# Altium project keyMANDevices.PrjPCB
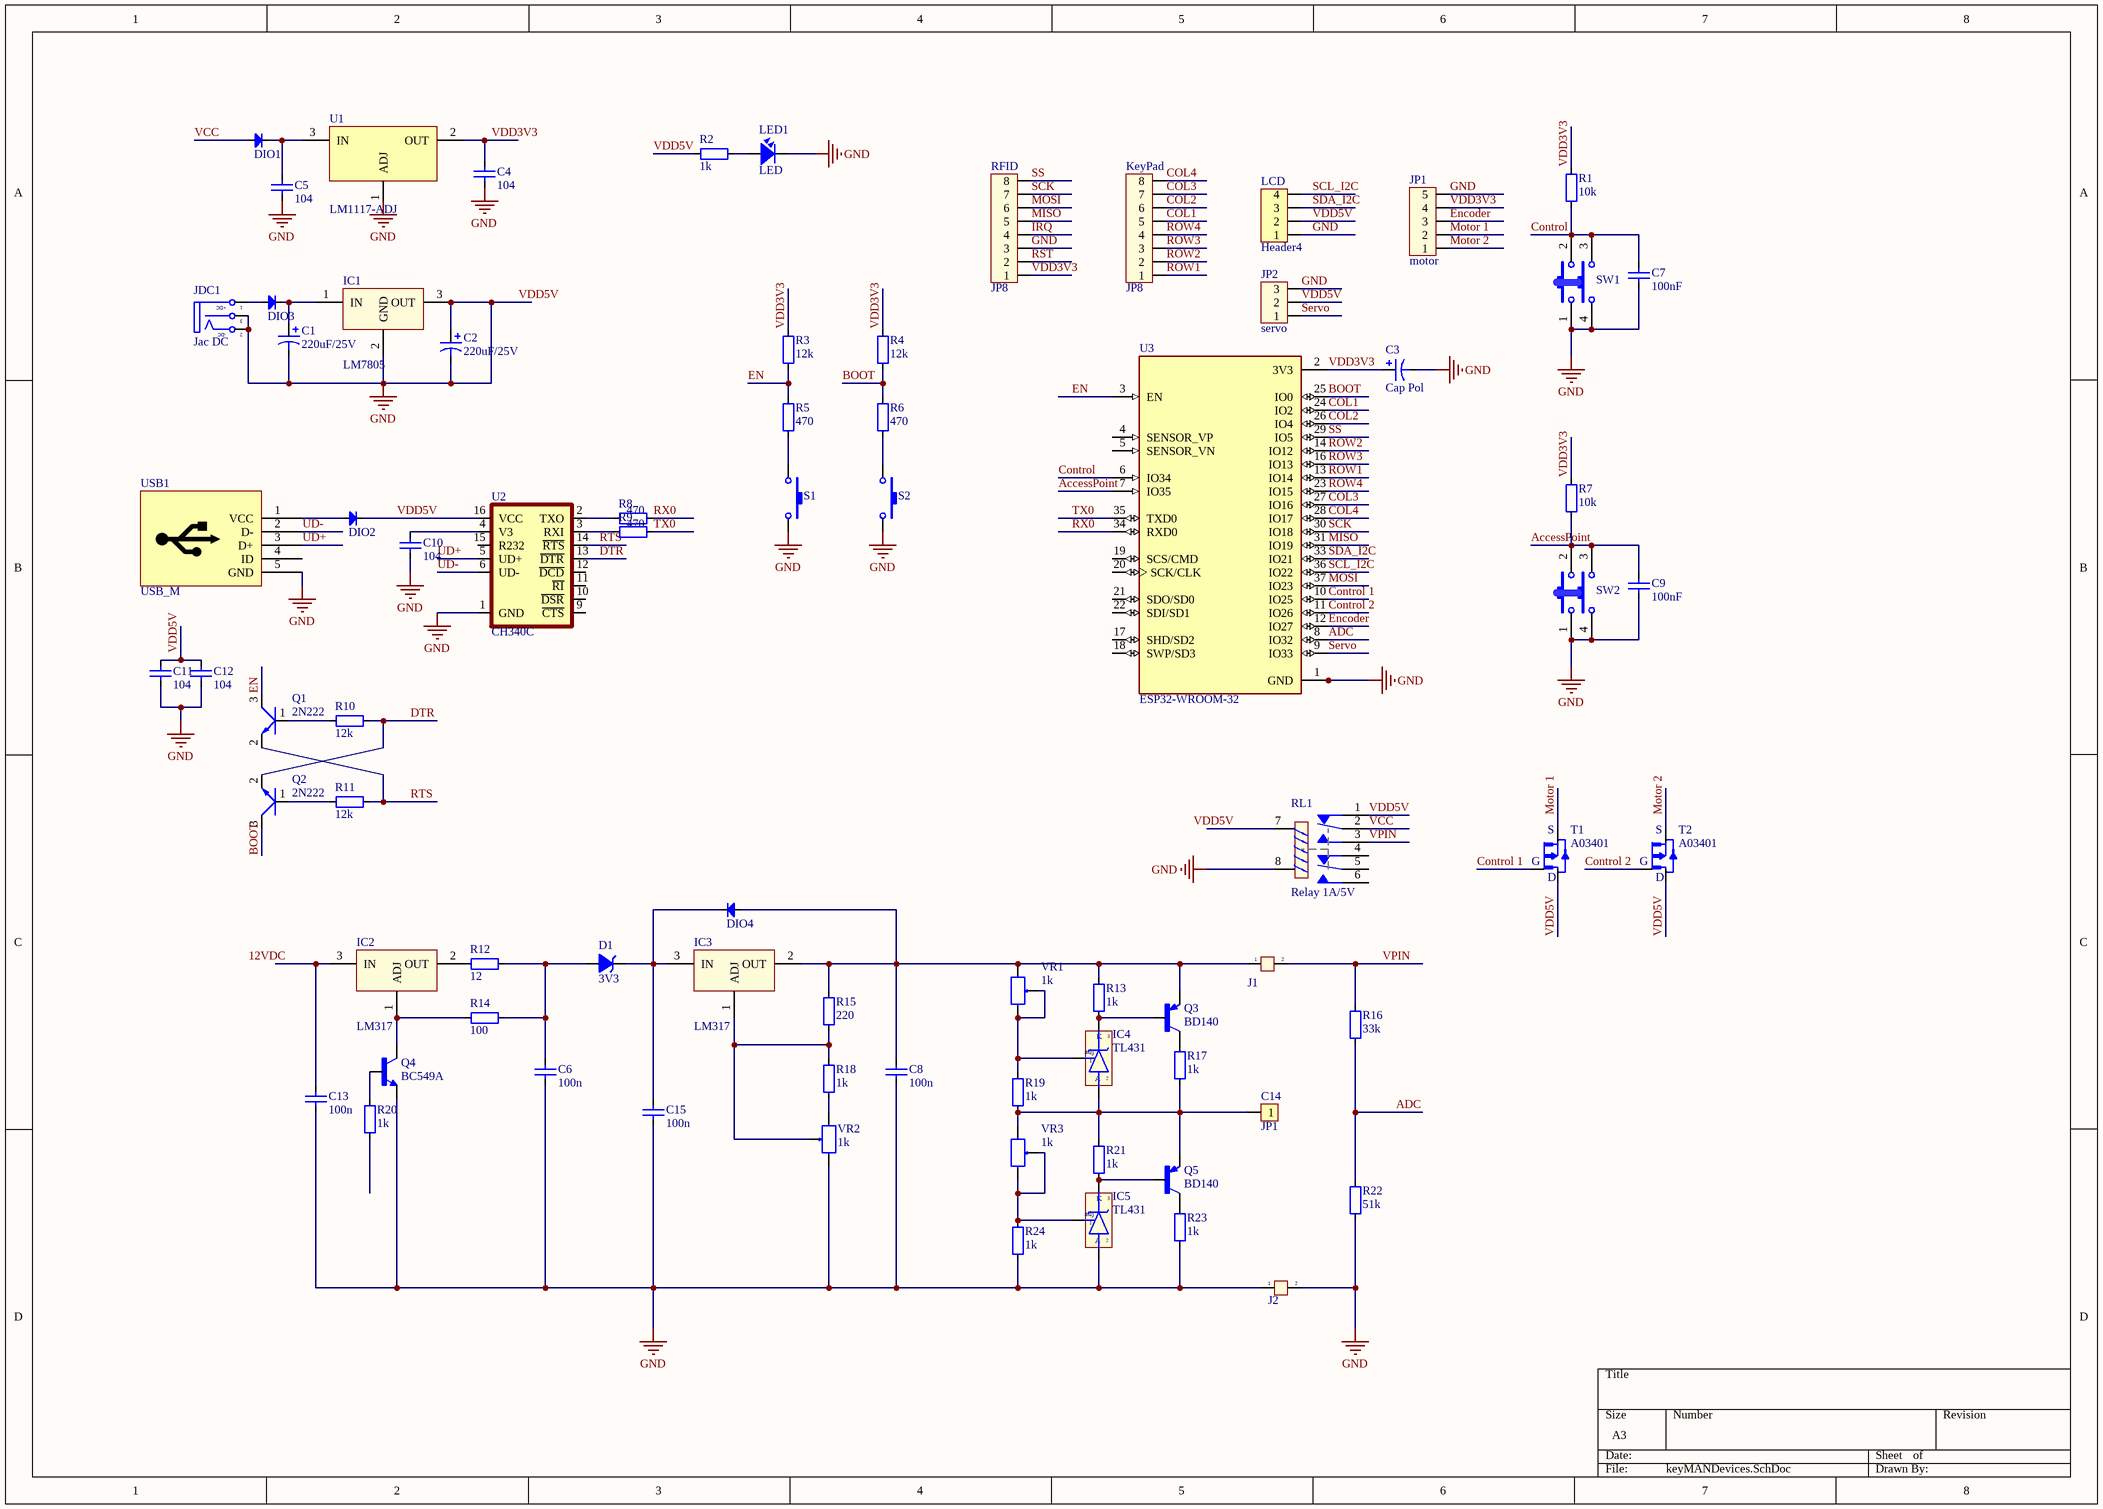
[diagram p0: keyMANDevices.SchDoc]
1 sheet, 77 parts. Net scope: global (net labels, ports and power ports of the same name join across sheets).
Board file: keyMANDevices.PcbDoc

## Sheet keyMANDevices.SchDoc
size A3

### Parts
C1  220uF/25V  [C3MM]
C2  220uF/25V  [C3MM]
C3  Cap Pol  [C3MM]
C4  104  [CAP_0805]
C5  104  [CAP_0805]
C6  100n  [CAP_0402]
C7  100nF  [CAP_0402]
C8  100n  [CAP_0402]
C9  100nF  [CAP_0402]
C10  104  [CAP_0805]
C11  104  [CAP_0402]
C12  104  [CAP_0805]
C13  100n  [CAP_0402]
C14  JP1  [JP1-D1T]
C15  100n  [CAP_0402]
D1  3V3  [DZ0.5A]
DIO1  Diode SMD  [DIO-SMD-106]  (value not drawn)
DIO2  Diode SMD  [DIO-SMD-106]  (value not drawn)
DIO3  Diode SMD  [DIO-SMD-106]  (value not drawn)
DIO4  Diode SMD  [DIO-SMD-106]  (value not drawn)
IC1  LM7805  [QTO-220]
IC2  LM317  [QTO-220]
IC3  LM317  [QTO-220]
IC4  TL431  [qto-92]
IC5  TL431  [qto-92]
J1  Jumper 2  [jp2h]  (value not drawn)
J2  Jumper 2  [jp2h]  (value not drawn)
JDC1  Jac DC  [DC-IN]
JP1  motor  [CON5]
JP2  servo  [CON3]
KeyPad  JP8  [Header8]
LCD  Header4  [HDR4]
LED1  LED  [LED-0805-Red]
Q1  2N222  [SOT23D]
Q2  2N222  [SOT23D]
Q3  BD140  [TO245P780X300X1364-3]
Q4  BC549A  [TO92250P510H770-3]
Q5  BD140  [TO245P780X300X1364-3]
R1  10k  [RES-SMD-0805]
R2  1k  [RES-SMD-0805]
R3  12k  [RES-SMD-0805]
R4  12k  [RES-SMD-0805]
R5  470  [RES-SMD-0805]
R6  470  [RES-SMD-0805]
R7  10k  [RES-SMD-0805]
R8  470  [RES-SMD-0805]
R9  470  [RES-SMD-0805]
R10  12k  [RES-SMD-0805]
R11  12k  [RES-SMD-0805]
R12  12  [RES-SMD-0101]
R13  1k  [RES-SMD-0101]
R14  100  [RES-SMD-0101]
R15  220  [RES-SMD-0101]
R16  33k  [RES-SMD-0101]
R17  1k  [RES-SMD-0101]
R18  1k  [RES-SMD-0101]
R19  1k  [RES-SMD-0101]
R20  1k  [RES-SMD-0101]
R21  1k  [RES-SMD-0101]
R22  51k  [RES-SMD-0101]
R23  1k  [RES-SMD-0101]
R24  1k  [RES-SMD-0101]
RFID  JP8  [Header8]
RL1  Relay 1A/5V  [RL_DPDT_1A]
S1  SW-SMD  [SW 3x2x4]  (value not drawn)
S2  SW-SMD  [SW 3x2x4]  (value not drawn)
SW1  SW-4P-S  [SW-4P-S]  (value not drawn)
SW2  SW-4P-S  [SW-4P-S]  (value not drawn)
T1  A03401  [A3401]
T2  A03401  [A3401]
U1  LM1117-ADJ  [LM1117-SOP]
U2  CH340C  [SO016]
U3  ESP32-WROOM-32  [MODULE_ESP32-WROOM-32]
USB1  USB_M  [USB_B_MINI_SMD]
VR1  1k  [VR]
VR2  1k  [VR]
VR3  1k  [VR]

### Nets
GND: C1.2 C2.1 C2.2 C3.2 C4.1 C5.1 C6.1 C7.1 C8.1 C9.1 C10.1 C11.1 C11.2 C12.1 C12.2 C13.1 C15.1 DIO2.2(K) IC1.2(GND) IC1.3(OUT) IC5.2(A) J2.1 J2.2 JDC1.2(TN) JDC1.3(S) JP1.5 JP2.2 JP2.3 LCD.1 LCD.2 LED1.2 Q4.3(E) R2.1 R22.1 R23.1 R24.1 RFID.3 RL1.1 RL1.8 S1.2 S2.2 SW1.1 SW1.4 SW2.1 SW2.4 T1.3(D) T2.3(D) U1.1(ADJ) U2.1(GND) U2.16(VCC) U3.1(GND) U3.15(GND) U3.38(GND) U3.39_1(GND) U3.39_2(GND) U3.39_3(GND) U3.39_4(GND) U3.39_5(GND) U3.39_6(GND) U3.39_7(GND) U3.39_8(GND) U3.39_9(GND) U3.39_10(GND) U3.39_11(GND) U3.39_12(GND) U3.39_13(GND) U3.39_14(GND) U3.39_15(GND) U3.39_16(GND) U3.39_17(GND) U3.39_18(GND) U3.39_19(GND) U3.39_20(GND) U3.39_21(GND) USB1.5(GND) VR2.1  [also labelled VDD5V]
AccessPoint: C9.2 R7.2 SW2.2 SW2.3 U3.7(IO35)
ADC: R16.1 R22.2 U3.8(IO32)
BOOT: Q2.3(C) R4.1 R6.2 U3.25(IO0)
COL1: KeyPad.5 U3.24(IO2)
COL2: KeyPad.6 U3.26(IO4)
COL3: KeyPad.7 U3.27(IO16)
COL4: KeyPad.8 U3.28(IO17)
Control: C7.2 R1.2 SW1.2 SW1.3 U3.6(IO34)
Control 1: T1.1(G) U3.10(IO25)
Control 2: T2.1(G) U3.11(IO26)
DTR: Q2.2(E) R10.2 U2.13(~{DTR})
EN: Q1.3(C) R3.1 R5.2 U3.3(EN)
Encoder: JP1.3 U3.12(IO27)
IRQ: RFID.4
MISO: RFID.5 U3.31(IO19)
MOSI: RFID.6 U3.37(IO23)
Motor 1: JP1.2 T1.2(S)
Motor 2: JP1.1 T2.2(S)
ROW1: KeyPad.1 U3.13(IO14)
ROW2: KeyPad.2 U3.14(IO12)
ROW3: KeyPad.3 U3.16(IO13)
ROW4: KeyPad.4 U3.23(IO15)
RST: RFID.2
RTS: Q1.2(E) R11.2 U2.14(~{RTS})
RX0: R8.2 U3.34(RXD0)
SCK: RFID.7 U3.30(IO18)
SCL_I2C: LCD.4 U3.36(IO22)
SDA_I2C: LCD.3 U3.33(IO21)
Servo: JP2.1 U3.9(IO33)
SS: RFID.8 U3.29(IO5)
TX0: R9.2 U3.35(TXD0)
UD+: U2.5(UD+) USB1.3(D+)
UD-: U2.6(UD-) USB1.2(D-)
VCC: DIO1.1(A) RL1.2
VDD3V3: C3.1 C4.2 JP1.4 R1.1 R3.2 R4.2 R7.1 RFID.1 U1.2(OUT) U3.2(3V3)
VPIN: J1.2 R16.2 RL1.3
NetC1_1: C1.1 DIO3.2(K) IC1.1(IN)
NetC5_2: C5.2 DIO1.2(K) U1.3(IN)
NetC6_2: C6.2 D1.1(A) R12.2 R14.2
NetC8_2: C8.2 DIO4.1(A) IC3.2(OUT) J1.1 Q3.1(E) R13.2 R15.2 VR1.1
NetC10_2: C10.2 U2.4(V3)
NetC13_2: C13.2 IC2.3(IN)
NetC14_1: C14.1 IC4.2(A) Q5.1(E) R17.1 R19.1 R21.2 VR3.1
NetC15_2: C15.2 D1.2(K) DIO4.2(K) IC3.3(IN)
NetDIO2_1: DIO2.1(A) USB1.1(VCC)
NetDIO3_1: DIO3.1(A) JDC1.1(T)
NetIC2_1: IC2.1(ADJ) Q4.1(C) R14.1
NetIC2_2: IC2.2(OUT) R12.1
NetIC3_1: IC3.1(ADJ) R15.1 R18.2 VR2.2
NetIC4_1: IC4.1(adj) R19.2 VR1.2 VR1.3
NetIC4_3: IC4.3(K) Q3.3(B) R13.1
NetIC5_1: IC5.1(adj) R24.2 VR3.2 VR3.3
NetIC5_3: IC5.3(K) Q5.3(B) R21.1
NetLED1_1: LED1.1 R2.2
NetQ1_1: Q1.1(B) R10.1
NetQ2_1: Q2.1(B) R11.1
NetQ3_2: Q3.2(C) R17.2
NetQ4_2: Q4.2(B) R20.2
NetQ5_2: Q5.2(C) R23.2
NetR5_1: R5.1 S1.1
NetR6_1: R6.1 S2.1
NetR8_1: R8.1 U2.2(TXO)
NetR9_1: R9.1 U2.3(RXI)
NetR18_1: R18.1 VR2.3

Not connected (* = marked no-connect by the designer): R20 1; RL1 4 5 6 7; U2 9(~{CTS}) 10(~{DSR}) 11(~{RI}) 12(~{DCD}) 15(R232); U3 4(SENSOR_VP) 5(SENSOR_VN) 17(SHD/SD2) 18(SWP/SD3) 19(SCS/CMD) 20(SCK/CLK) 21(SDO/SD0) 22(SDI/SD1); USB1 4(ID)

### Notes on the sheet
- Labels drawn without touching a wire or pin: 12VDC, VDD5V
- (in symbol DCIN) +DC; -DC

### Library data of the parts
C1-C3 = Cap Pol: Polarized Capacitor (Axial); Published: 8-Jun-2000; LatestRevisionDate: 17-Jul-2002; LatestRevisionNote: Re-released for DXP Platform.; PackageReference: POLAR0.8; Publisher: Altium Limited
C4-C13 C15 = CapSMD: Capacitor; Value: 33p; Published: 8-Jun-2000; LatestRevisionDate: 17-Jul-2002; LatestRevisionNote: Re-released for DXP Platform.; PackageReference: RAD-0.3; Publisher: Altium Limited
C14 = JP1: WR-PHD 2.54 mm Angled Socket Header; Manufacturer: W¨¹rth Elektronik eiSos GmbH; partNo: 613002143121; ComponentLink1 Description: Manufacturer; ComponentLink2 Description: Datasheet; NoPins: 02; Created Date: 29 March 2013; ComponentLink1URL: http://www.we-online.com; ComponentLink2URL: http://katalog.we-online.de/em/datasheet/6130xx143121.pdf; Created by: Karrer Zheng
D1 = DZ: Diode Zenner; Value: 3v3
DIO1-DIO4 = Diode SMD: Default Diode; Code - JEDEC: DO-214-AB; Value: 1N5007; Published: 8-Jun-2000; Revision: July-2002: Re-released for DXP Platform.; Publisher: Altium Limited
IC1 = LM78xx: On ap +, from + 5 to + 24VDC; Value: LM7805
IC2 IC3 = LM317: Adj Voltage +1.2 -> +37V; Value: LM317
IC4 IC5 = TL431: Programmable Shunt Regulator; Value: TL431
J1 J2 = JP 2: Value: JP 2
JDC1 = DCIN: Jac DC input; Value: Jac DC
JP1 = Con5: Connector 5; Value: Connector 5
JP2 = Con3: Connector 3; Value: Connector 3
KeyPad RFID = Header8: Connector 8; Value: Connector 8
LCD = Header4: Header IDC, 4 x 1 Pin Vertical 2.54mm Pitch (Non-Boxed, Male); Manufacturer: W¨¹rth Elektronik eiSos GmbH; partNo: 613002143121; ComponentLink1 Description: Manufacturer; ComponentLink2 Description: Datasheet; NoPins: 02; Created Date: 29 March 2013; ComponentLink1URL: http://www.we-online.com; ComponentLink2URL: http://katalog.we-online.de/em/datasheet/6130xx143121.pdf; Created by: Karrer Zheng
LED1 = LED: LED Single colour Green and Red; Value: LED 3 ly Single Colour
Q1 Q2 = 2N222: NPN 600mW, ECB; Value: C1815
Q3 Q5 = BD140: TRANS PNP 80V 1.5A SOT-32; Value: *; MP: BD140; Package: None; Availability: Unavailable; Price: None
Q4 = BC549A: TO-92 30V 0.1A NPN Bipolar Transistor; MF: Taiwan Semiconductor; Value: *; Purchase-URL: https://pricing.snapeda.com/search/part/BC549A/?ref=eda; Package: TO-92 Taiwan Semiconductor; MP: BC549A; Check_prices: https://www.snapeda.com/parts/BC549A/Taiwan+Semiconductor/view-part/?ref=eda; SnapEDA_Link: https://www.snapeda.com/parts/BC549A/Taiwan+Semiconductor/view-part/?ref=snap; Price: None; Availability: In Stock
R1-R24 = Resistor - SMD: Resistor; Manufacturer: Generic Components; Class: Passive; Published: 08/06/2000; Publisher: Altium Hobart Technology Centre
RL1 = Relay 2: Relay DPDT; Discription: Relay DPDT 5V, 12V - 1A - 5A; Value: Relay - 5V - 1A
S1 S2 = SW-SMD: Switch; Published: 24-Mar-1999; LatestRevisionDate: 17-Jul-2002; LatestRevisionNote: Re-released for DXP Platform.; PackageReference: SPST-2; Publisher: Altium Limited
SW1 SW2 = SW-4PIN-SMALL: Switch Small 4 Pin; Published: 24-Mar-1999; LatestRevisionDate: 17-Jul-2002; LatestRevisionNote: Re-released for DXP Platform.; PackageReference: SPST-2; Publisher: Altium Limited
T1 T2 = A03401: P-Channel 30V 4A _Ta_ 1.4W _Ta_ Surface Mount SOT-23-3
U1 = LM1117-ADJ: 800mA Low-Dropout Linear Regulator; Creator: Nguyen Ba Bien; Website: http://group3i.net
U2 = CH340C: USB to serial chip CH340; MF: WCH; Package: Package; Check_prices: https://www.snapeda.com/parts/CH340C/WCH/view-part/5428851/?ref=eda; Value: *; Price: None; MP: CH340C; Availability: Unavailable; SnapEDA_Link: https://www.snapeda.com/parts/CH340C/WCH/view-part/5428851/?ref=snap
U3 = ESP32-WROOM-32: Bluetooth, WiFi Transceiver Module 2.4GHz ~ 2.5GHz Surface Mount; MF: Espressif Systems; Package: Module Espressif Systems; Digi-Key_Part_Number: 1904-1010-1-ND; Digi-Key_Purchase_URL: https://www.digikey.com/product-detail/en/espressif-systems/ESP32-WROOM-32/1904-1010-1-ND/8544305?utm_source=snapeda&utm_medium=aggregator&utm_campaign=symbol; Value: *; MP: ESP32-WROOM-32; SnapEDA_Link: https://www.snapeda.com/parts/ESP32-WROOM-32/Espressif%20Systems/view-part/2753322/?ref=snap
VR1-VR3 = VR_1: Var Resistor; Value: VR 10K